# EAGLE design pinky 2.2 (v-usb) (EAGLE 6.4)
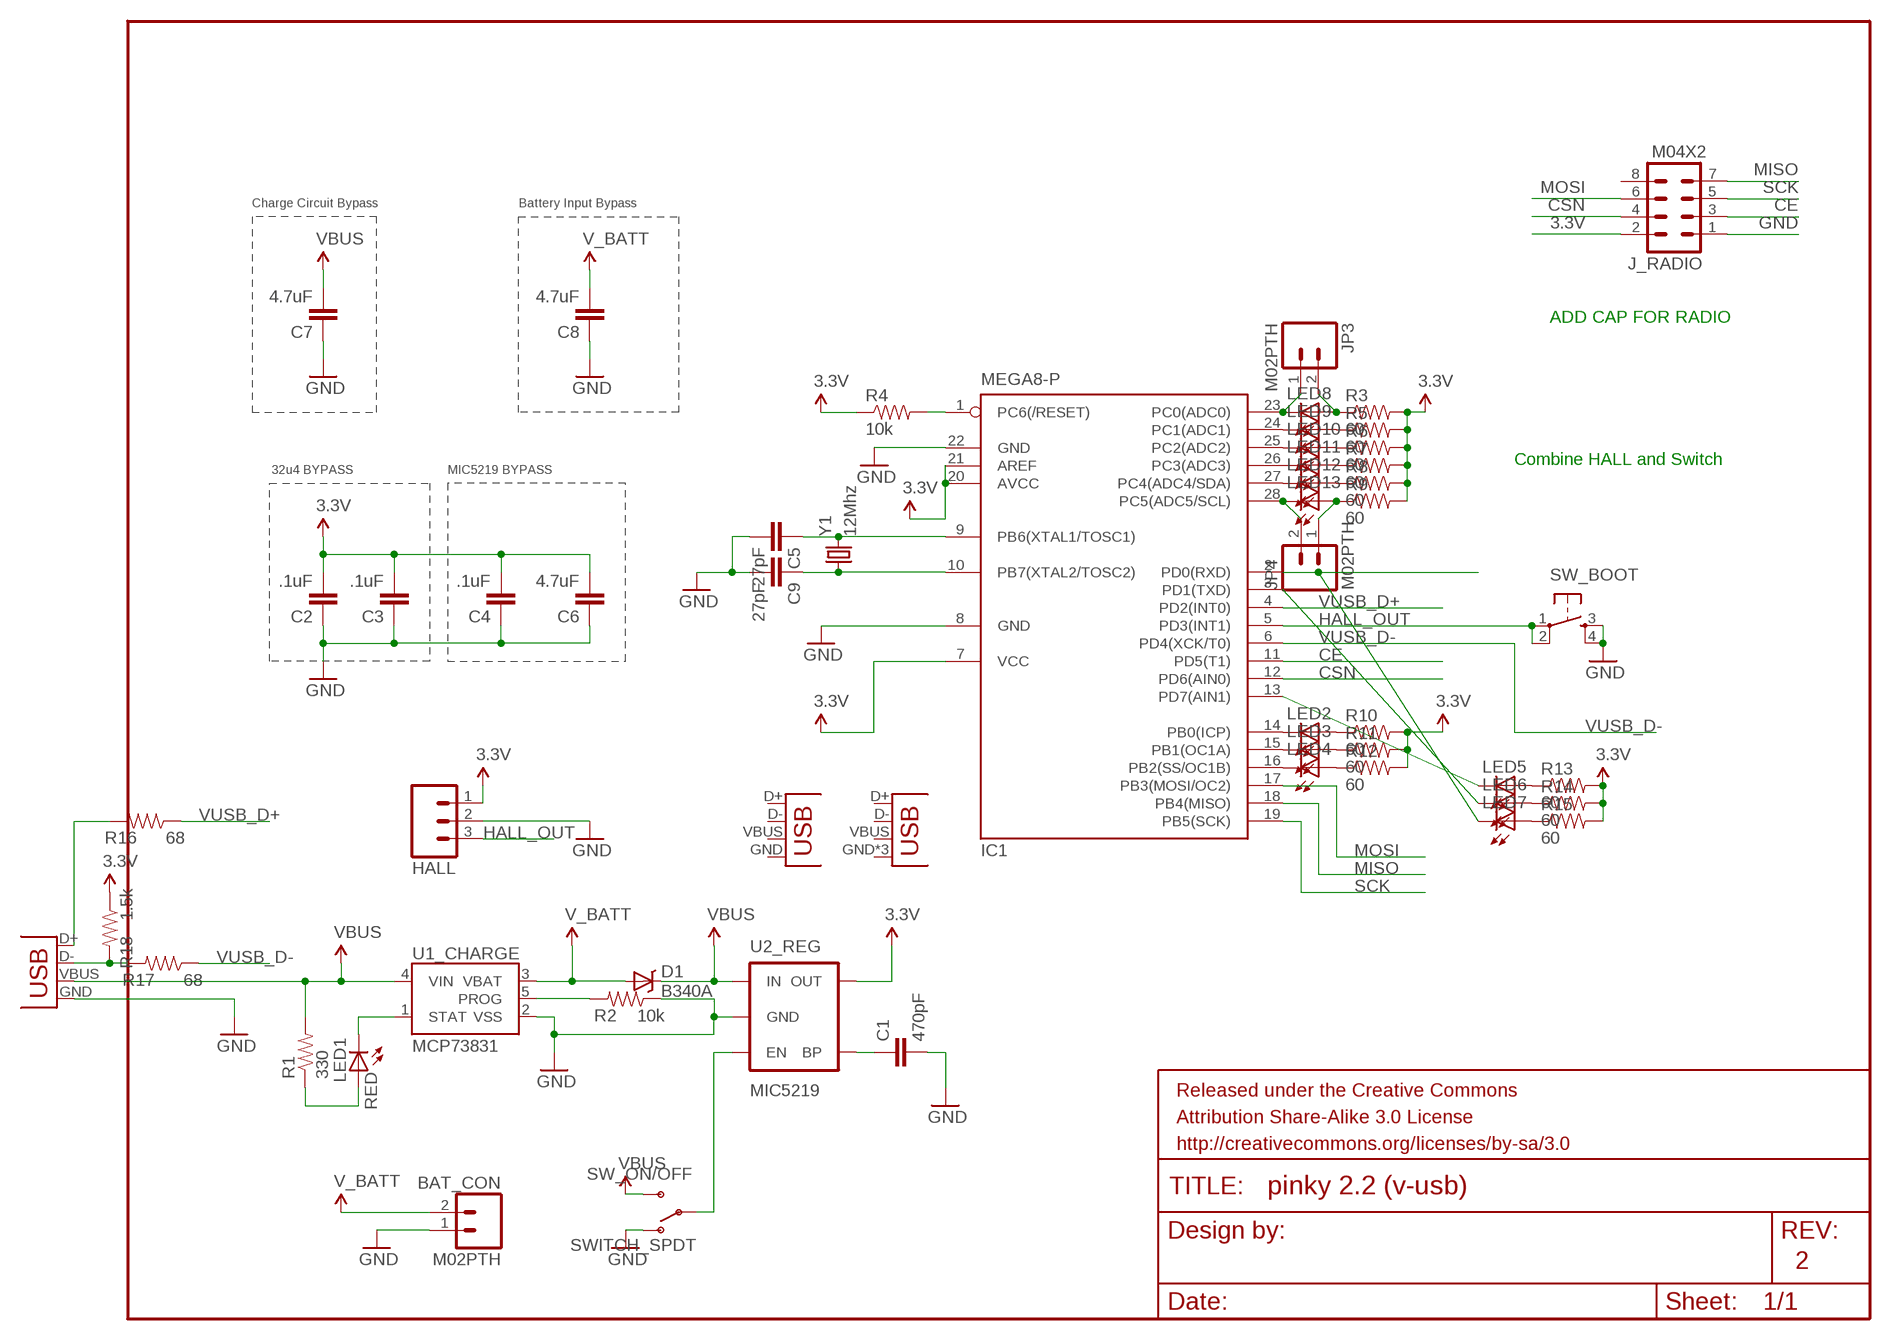
[diagram p0: schematic, sheet 1]

## Parts
BAT_CON  M02PTH  [1X02]
C1  470pF  CAP1206  [1206]
C2  .1uF  CAP1206  [1206]
C3  .1uF  CAP1206  [1206]
C4  .1uF  CAP1206  [1206]
C5  27pF  CAP1206  [1206]
C6  4.7uF  CAP1206  [1206]
C7  4.7uF  CAP1206  [1206]
C8  4.7uF  CAP1206  [1206]
C9  27pF  CAP1206  [1206]
D1  B340A  DIODE-SCHOTTKY_  [SMA-DIODE]
HALL  M03PTH  [1X03]
IC1  MEGA8-P  [DIL28-3]
J_RADIO  M04X2  [2X4]
JP1  USB-MB-H  [USB-MB-H]
JP2  USB-MICROB  [USB-MICROB]
JP3  M02PTH  [1X02]
JP4  M02PTH  [1X02]
LED1  RED  LED1206  [LED-1206]
LED2  LED1206  [LED-1206]
LED3  LED1206  [LED-1206]
LED4  LED1206  [LED-1206]
LED5  LED1206  [LED-1206]
LED6  LED1206  [LED-1206]
LED7  LED1206  [LED-1206]
LED8  LED1206  [LED-1206]
LED9  LED1206  [LED-1206]
LED10  LED1206  [LED-1206]
LED11  LED1206  [LED-1206]
LED12  LED1206  [LED-1206]
LED13  LED1206  [LED-1206]
R1  330  RESISTOR1206  [1206]
R2  10k  RESISTOR1206  [1206]
R3  60  RESISTOR1206  [1206]
R4  10k  RESISTOR1206  [1206]
R5  60  RESISTOR1206  [1206]
R6  60  RESISTOR1206  [1206]
R7  60  RESISTOR1206  [1206]
R8  60  RESISTOR1206  [1206]
R9  60  RESISTOR1206  [1206]
R10  60  RESISTOR1206  [1206]
R11  60  RESISTOR1206  [1206]
R12  60  RESISTOR1206  [1206]
R13  60  RESISTOR1206  [1206]
R14  60  RESISTOR1206  [1206]
R15  60  RESISTOR1206  [1206]
R16  68  RESISTOR1206  [1206]
R17  68  RESISTOR1206  [1206]
R18  1.5k  RESISTOR1206  [1206]
SW_BOOT  TAC_SWITCHPTH  [TACTILE-PTH]
SW_ON/OFF  SWITCH_SPDT  [KPS-1290]
U1_CHARGE  MCP73831  [SOT23-5]
U2_REG  MIC5219  V_REG_MIC5219SMD  [SOT23-5]
X1_USB_MICRO  USBSMD  [USB-MINIB]
Y1  12Mhz  CRYSTAL5X3  [CRYSTAL-SMD-5X3]

## Nets
3.3V: C2.2 C3.2 C4.2 C6.2 HALL.1 IC1.7(VCC) IC1.20(AVCC) IC1.21(AREF) J_RADIO.2 R3.2 R4.1 R5.2 R6.2 R7.2 R8.2 R9.2 R10.2 R11.2 R12.2 R13.2 R14.2 R15.2 R18.1 U2_REG.5(OUT)
5V: C7.2 D1.C R1.2 SW_ON/OFF.S U1_CHARGE.4(VIN) U2_REG.1(IN) X1_USB_MICRO.VBUS ; supply symbol labelled VBUS
CE: IC1.11(PD5(T1)) J_RADIO.3
CSN: IC1.12(PD6(AIN0)) J_RADIO.4
GND: BAT_CON.1 C1.2 C2.1 C3.1 C4.1 C5.2 C6.1 C7.1 C8.1 C9.2 HALL.2 IC1.8(GND) IC1.22(GND) J_RADIO.1 R2.1 SW_BOOT.3 SW_BOOT.4 SW_ON/OFF.O U1_CHARGE.2(VSS) U2_REG.2(GND) X1_USB_MICRO.GND
HALL_OUT: HALL.3 IC1.5(PD3(INT1)) SW_BOOT.1 SW_BOOT.2
MISO: IC1.18(PB4(MISO)) J_RADIO.7
MOSI: IC1.17(PB3(MOSI/OC2)) J_RADIO.6
N$1: IC1.1(PC6(/RESET)) R4.2
N$2: SW_ON/OFF.P U2_REG.3(EN)
N$3: LED1.A R1.1
N$4: LED1.C U1_CHARGE.1(STAT)
N$5: IC1.14(PB0(ICP)) LED2.C
N$6: R2.2 U1_CHARGE.5(PROG)
N$7: IC1.15(PB1(OC1A)) LED3.C
N$8: C1.1 U2_REG.4(BP)
N$9: IC1.16(PB2(SS/OC1B)) LED4.C
N$10: IC1.2(PD0(RXD)) LED7.C
N$11: IC1.13(PD7(AIN1)) LED5.C
N$12: IC1.3(PD1(TXD)) LED6.C
N$13: IC1.23(PC0(ADC0)) JP3.1 LED8.C
N$14: IC1.24(PC1(ADC1)) LED9.C
N$15: IC1.25(PC2(ADC2)) LED10.C
N$16: IC1.26(PC3(ADC3)) LED11.C
N$17: IC1.27(PC4(ADC4/SDA)) LED12.C
N$18: IC1.28(PC5(ADC5/SCL)) JP4.2 LED13.C
N$19: JP3.2 LED8.A R3.1
N$20: LED9.A R5.1
N$21: LED10.A R6.1
N$22: LED11.A R7.1
N$23: LED12.A R8.1
N$25: JP4.1 LED13.A R9.1
N$26: LED2.A R10.1
N$27: LED3.A R11.1
N$28: LED4.A R12.1
N$29: LED5.A R13.1
N$30: LED6.A R14.1
N$31: LED7.A R15.1
N$32: R16.2 X1_USB_MICRO.D+
N$33: R17.2 R18.2 X1_USB_MICRO.D-
N$34: C5.1 IC1.9(PB6(XTAL1/TOSC1)) Y1.3
N$35: C9.1 IC1.10(PB7(XTAL2/TOSC2)) Y1.1
SCK: IC1.19(PB5(SCK)) J_RADIO.5
V_BATT: BAT_CON.2 C8.2 D1.A U1_CHARGE.3(VBAT)
VUSB_D+: IC1.4(PD2(INT0)) R16.1
VUSB_D-: IC1.6(PD4(XCK/T0)) R17.1
Unconnected: J_RADIO.8 JP1.D+ JP1.D- JP1.GND JP1.VBUS JP2.D+ JP2.D- JP2.GND JP2.MT1(GND) JP2.MT2(GND) JP2.VBUS

## Notes on the sheet
- Charge Circuit Bypass | Battery Input Bypass
- ADD CAP FOR RADIO
- Combine HALL and Switch
- 32u4 BYPASS | MIC5219 BYPASS
- 2

## Library data of the parts
BAT_CON JP3 JP4 = SparkFun-Connectors:M02: Standard 2-pin 0.1" header. Use with - straight break away headers ( PRT-00116) - right angle break away headers (PRT-00553) - swiss pins (PRT-00743) - machine pins (PRT-00117) - female headers (PRT-00115) Molex polarized connector foot print use with: PRT-08233 with associated crimp pins and housings. 2.54_SCREWTERM for use with PRT-10571. 3.5mm Screw Terminal footprints for PRT-08084 5mm Screw Terminal footprints for use with PRT-08433
C1 = SparkFun-Passives:CAP: Capacitor Standard 0603 ceramic capacitor, and 0.1" leaded capacitor.; PROD_ID: CAP-07884
C2-C4 = SparkFun-Passives:CAP: Capacitor Standard 0603 ceramic capacitor, and 0.1" leaded capacitor.; PROD_ID: CAP-00810
C5 C7-C9 = SparkFun-Passives:CAP: Capacitor Standard 0603 ceramic capacitor, and 0.1" leaded capacitor.; PROD_ID: CAP-10300
C6 = SparkFun-Passives:CAP: Capacitor Standard 0603 ceramic capacitor, and 0.1" leaded capacitor.; PROD_ID: CAP-08280
D1 = SparkFun-DiscreteSemi:DIODE-SCHOTTKY: Commonly MBRA140.; PROD_ID: DIO-09886
HALL = SparkFun-Connectors:M03: Header 3 Standard 3-pin 0.1" header. Use with straight break away headers (SKU : PRT-00116), right angle break away headers (PRT-00553), swiss pins (PRT-00743), machine pins (PRT-00117), and female headers (PRT-00115). Molex polarized connector foot print use with SKU : PRT-08232 with associated crimp pins and housings.
IC1 = atmel:MEGA8-P: MICROCONTROLLER 8 Kbytes FLASH, 1 kbytes SRAM, 512 bytes EEPROM, USART, 4-channel 10 bit ADC, 2-channel 8 bit ADC Pin compatible with Atmega48, ATMega88, ATMega168 Source: avr.lbr; OC_FARNELL: unknown; OC_NEWARK: unknown
J_RADIO = SparkFun-Connectors:M04X2: .1" header, two rows of four.
JP1 X1_USB_MICRO = SparkFun-Connectors:USB: USB Connectors USB-B-PTH is fully proven SKU : PRT-00139/CONN-08278 USB-miniB is fully proven SKU : PRT-00587 USB-A-PCB is untested. USB-A-H is throughly reviewed, but untested. Spark Fun Electronics SKU : PRT-00437 USB-B-SMT is throughly reviewed, but untested. Needs silkscreen touching up. USB-A-S has not been used/tested USB-MB-H has not been used/tested USB-MICROB has been used. CONN-09505
JP2 = SparkFun-Connectors:USB: USB Connectors USB-B-PTH is fully proven SKU : PRT-00139/CONN-08278 USB-miniB is fully proven SKU : PRT-00587 USB-A-PCB is untested. USB-A-H is throughly reviewed, but untested. Spark Fun Electronics SKU : PRT-00437 USB-B-SMT is throughly reviewed, but untested. Needs silkscreen touching up. USB-A-S has not been used/tested USB-MB-H has not been used/tested USB-MICROB has been used. CONN-09505; PROD_ID: CONN-09505
LED1 = SparkFun-LED:LED: LEDs Standard schematic elements and footprints for 5mm, 3mm, 1206, and 0603 sized LEDs. 5mm - Spark Fun Electronics SKU : COM-00529 (and others); PROD_ID: DIO-00819
LED2-LED13 = SparkFun-LED:LED: LEDs Standard schematic elements and footprints for 5mm, 3mm, 1206, and 0603 sized LEDs. 5mm - Spark Fun Electronics SKU : COM-00529 (and others)
R1 = SparkFun-Passives:RESISTOR: Resistor Basic schematic elements and footprints for 0603, 1206, and PTH resistors.; PROD_ID: RES-00818
R2-R18 = SparkFun-Passives:RESISTOR: Resistor Basic schematic elements and footprints for 0603, 1206, and PTH resistors.; PROD_ID: RES-00824
SW_BOOT = SparkFun-Electromechanical:TAC_SWITCH: Momentary Switch Button commonly used for reset or general input. Spark Fun Electronics SKU : COM-00097 SMT- SWCH-08247
SW_ON/OFF = SparkFun-Electromechanical:SWITCH_SPDT: Side-actuated SPDT slide switch, as used on the Arduino Pro
U1_CHARGE = SparkFun-PowerIC:MCP73831: Miniature single cell, fully integrated Li-Ion, Li-polymer charge management controller http://ww1.microchip.com/downloads/en/DeviceDoc/21984a.pdf; PROD_ID: IC-09995
U2_REG = SparkFun-PowerIC:V_REG_MIC5219: V_REG MIC5219 Standard 500mA LDO voltage regulator in SOT-23 layout. Micrel part MIC5219. BP (by-pass) pin is used to lower output noise with 470pF cap, may be left open.; PROD_ID: VREG-09872
Y1 = SparkFun-FreqCtrl:CRYSTAL: Various standard crystals. Proven footprints. Spark Fun Electronics SKU : COM-00534

## Board
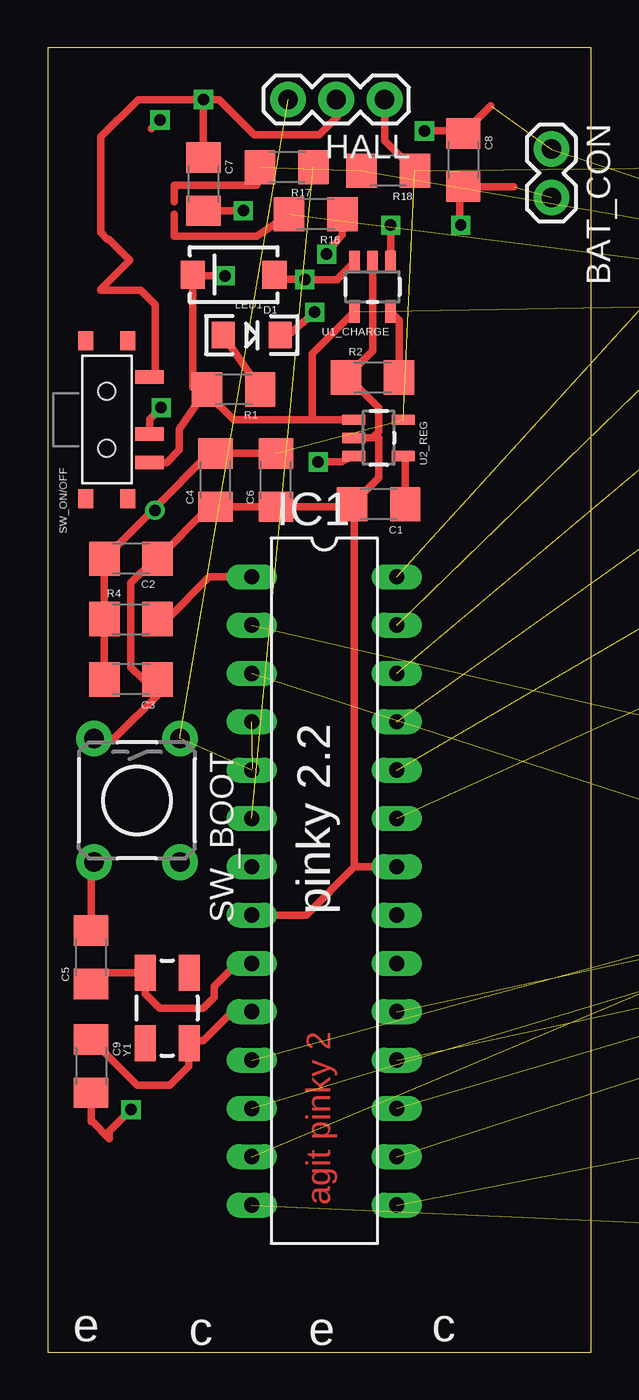
[diagram p1: board, top side]
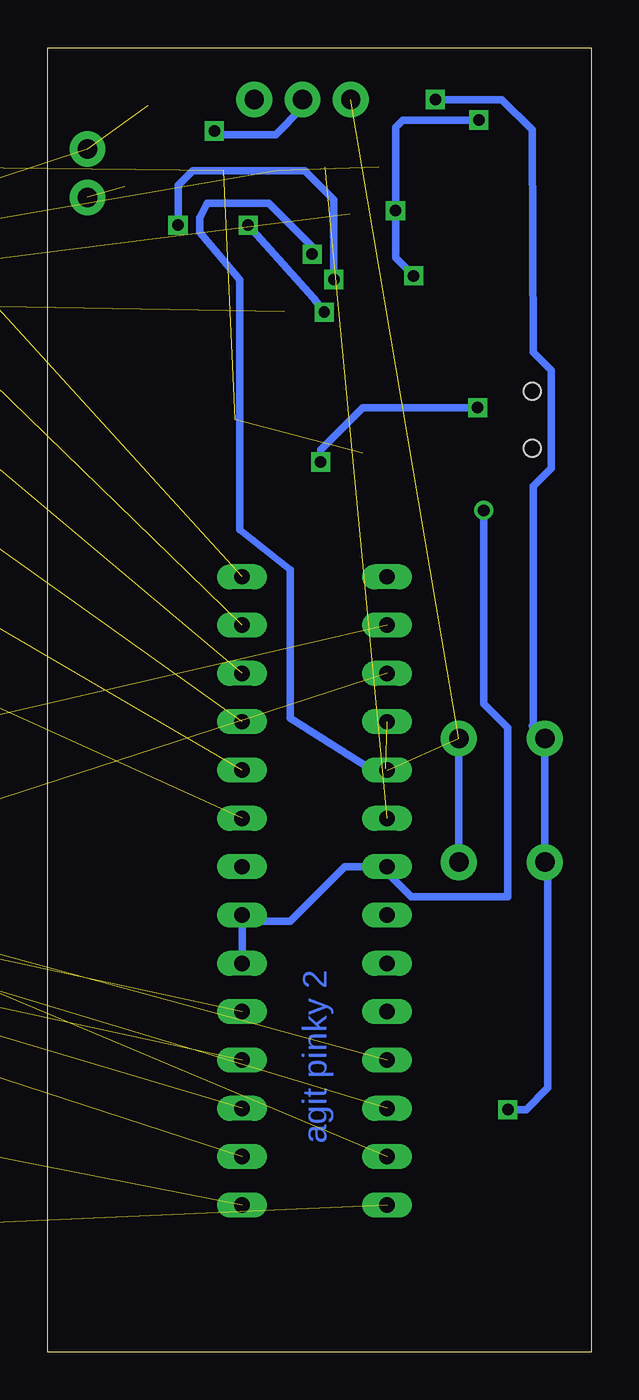
[diagram p2: board, bottom side, seen from below]

Size 28.57 x 68.58 mm. Coordinates in mm from the lower left corner, seen from the top.
Outline: 0,0 28.57,0 28.57,68.58 0,68.58 0,0
Copper layers (1*16): Top 0.035mm / dielectric 1.5mm / Bottom 0.035mm
Design rules "default *": minimum track width 16mil, minimum drill 24mil, track to track 8mil, track to pad 8mil, pad to pad 8mil, via to via 8mil, smd to smd 8mil, copper to edge 40mil, drill to drill 8mil, minimum pad ring 10mil, minimum via ring 8mil, stop-mask expansion 4mil, vias tented up to drill 0mil, thermal gap 10mil

### Footprints (pad centres in the part's own frame; a part is rotated, then mirrored left to right if it is on the bottom)
1X02 = drill 1.016 pad 1.88: 1 0,0; 2 2.54,0
1206 = smd 1.6 x 1.8: 1 -1.4,0; 2 1.4,0
SMA-DIODE = smd 1.27 x 1.47: A -2.15,0; C 2.15,0
1X03 = drill 1.016 pad 1.88: 1 0,0; 2 2.54,0; 3 5.08,0
DIL28-3 = drill 0.813 long: 1 -16.51,-3.81; 2 -13.97,-3.81; 3 -11.43,-3.81; 4 -8.89,-3.81; 5 -6.35,-3.81; 6 -3.81,-3.81; 7 -1.27,-3.81; 8 1.27,-3.81; 9 3.81,-3.81; 10 6.35,-3.81; 11 8.89,-3.81; 12 11.43,-3.81; 13 13.97,-3.81; 14 16.51,-3.81; 15 16.51,3.81; 16 13.97,3.81; 17 11.43,3.81; 18 8.89,3.81; 19 6.35,3.81; 20 3.81,3.81; 21 1.27,3.81; 22 -1.27,3.81; 23 -3.81,3.81; 24 -6.35,3.81; 25 -8.89,3.81; 26 -11.43,3.81; 27 -13.97,3.81; 28 -16.51,3.81
2X4 = drill 1.016 pad 1.88 octagon: 1 -3.81,-1.27; 2 -3.81,1.27; 3 -1.27,-1.27; 4 -1.27,1.27; 5 1.27,-1.27; 6 1.27,1.27; 7 3.81,-1.27; 8 3.81,1.27
USB-MB-H = drill 0.8: D+ 5.1,0; D- 3.9,0.8; GND 5.1,-1.6; ID 3.9,-0.8; VBUS 5.1,1.6 | drill 1.9: P$6 0,-3.65; P$7 0,3.65
USB-MICROB = smd 0.35 x 1.4: D+ 0,2.65; D- -0.65,2.65; GND 1.3,2.65; ID 0.65,2.65; VBUS -1.3,2.65 | smd 1.8 x 1.9: MT1 -4,0; MT2 4,0 | smd 1.9 x 1.9: P$1 -1.27,0; P$2 1.27,0
LED-1206 = smd 1.2 x 1.4: A -1.5,0; C 1.5,0
TACTILE-PTH = drill 1.016 pad 1.88: 1 -3.251,2.261; 2 3.251,2.261; 3 -3.251,-2.261; 4 3.251,-2.261
KPS-1290 = smd 0.7 x 1.5: O -2.25,2.25; P 0.75,2.25; S 2.25,2.25 | smd 1 x 0.8: P$1 -4.15,1.1; P$2 -4.15,-1.1; P$3 4.15,-1.1; P$4 4.15,1.1 | hole 0.9: -1.5,0; 1.5,0
SOT23-5 = smd 0.55 x 1.2: 1 -0.95,-1.3; 2 0,-1.3; 3 0.95,-1.3; 4 0.95,1.3; 5 -0.95,1.3
USB-MINIB = smd 2.5 x 0.5: D+ 2.5,0; D- 2.5,0.8; GND 2.5,-1.6; ID 2.5,-0.8; VBUS 2.5,1.6 | smd 2.5 x 2: MTN1 -3,4.5; MTN2 2.5,4.5; MTN3 -3,-4.5; MTN4 2.5,-4.5 | hole 0.9: 0,2.2; 0,-2.2
CRYSTAL-SMD-5X3 = smd 1.9 x 1.1: 1 -1.85,-1.15; 2 1.85,-1.15; 3 1.85,1.15; 4 -1.85,1.15

### Placement (x,y rotation side)
BAT_CON  26.48,63.25 270 top
C1  17.4,44.58 180 top
C2  4.38,41.72 180 top
C3  4.38,35.37 180 top
C4  8.83,45.85 90 top
C5  2.29,20.76 90 top
C6  12,45.85 90 top
C7  8.19,61.4 270 top
C8  21.84,62.67 270 top
C9  2.29,15.05 270 top
D1  9.78,56.64 180 top
HALL  17.72,65.85 180 top
IC1  14.54,24.26 270 top
J_RADIO  72.77,30.67 270 top  (outside the outline)
JP1  74.68,53.34 0 top  (outside the outline)
JP2  64.77,54.29 270 top  (outside the outline)
JP3  40.64,36.83 270 top  (outside the outline)
JP4  40.64,59.69 90 top  (outside the outline)
LED1  10.73,53.47 0 top
LED2  38.04,5.02 90 top  (outside the outline)
LED3  38.04,10.1 90 top  (outside the outline)
LED4  38.04,15.18 90 top  (outside the outline)
LED5  38.04,20.26 90 top  (outside the outline)
LED6  38.04,25.34 90 top  (outside the outline)
LED7  38.04,30.42 90 top  (outside the outline)
LED8  38.04,35.5 90 top  (outside the outline)
LED9  38.04,40.58 90 top  (outside the outline)
LED10  38.04,45.66 90 top  (outside the outline)
LED11  38.04,50.74 90 top  (outside the outline)
LED12  38.04,55.82 90 top  (outside the outline)
LED13  38.04,60.9 90 top  (outside the outline)
R1  9.78,50.61 180 top
R2  17.08,51.24 0 top
R3  35.5,35.5 90 top  (outside the outline)
R4  4.38,38.54 0 top
R5  35.56,40.58 90 top  (outside the outline)
R6  35.56,45.66 90 top  (outside the outline)
R7  35.56,50.74 90 top  (outside the outline)
R8  35.56,55.82 90 top  (outside the outline)
R9  35.56,60.9 90 top  (outside the outline)
R10  35.62,5.02 90 top  (outside the outline)
R11  35.62,10.1 90 top  (outside the outline)
R12  35.56,15.18 90 top  (outside the outline)
R13  35.56,20.26 90 top  (outside the outline)
R14  35.56,25.34 90 top  (outside the outline)
R15  35.56,30.42 90 top  (outside the outline)
R16  14.1,59.82 180 top
R17  12.57,62.29 180 top
R18  17.91,62.1 180 top
SW_BOOT  4.7,29.02 270 top
SW_ON/OFF  3.11,49.02 270 top
U1_CHARGE  17.08,56.01 180 top
U2_REG  17.4,48.07 270 top
X1_USB_MICRO  57.34,53.85 0 top  (outside the outline)
Y1  6.29,18.1 90 top

### Tracks (layer width: path | path; a pad name or v marks a point on that pad's centre or on a via)
3.3V  (via drill 0.61)  (15 unrouted)
  Top 0.406: C6.2 C4.2 8.51,47.25 5.59,44.33 | 5.59,44.33 C2.2 R4.1 C3.2 | v5.65,44.26 5.59,44.33 | HALL.1 17.72,63.69 R18.1
  Bottom 0.406: IC1.20 IC1.21 18.03,22.67 15.81,22.67 12.95,25.53 IC1.7 10.73,25.21 9.46,23.94 4.38,23.94 4.38,32.83 5.65,34.1 v5.65,44.26
5V  (via drill 0.6)  (1 unrouted)
  Top 0.406: R1.2 7.63,50.72 D1.C 7.69,56.58 v9.34,56.58 | SW_ON/OFF.S 6.26,46.77 6.92,47.43 6.92,48.52 R1.2 | R1.2 8.38,50.42 9.78,49.02 13.91,49.02 | 13.91,49.02 U2_REG.1 13.91,49.02 | 13.91,49.02 13.91,52.48 U1_CHARGE.4 | C7.2 v10.29,60.01 | 5.44,64.31 v5.91,64.77
  Bottom 0.406: v9.34,56.58 10.29,57.53 v10.29,60.01 10.29,64.39 9.91,64.77 v5.91,64.77
CE  (1 unrouted)
CSN  (1 unrouted)
GND  (via drill 0.6)  (3 unrouted)
  Top 0.406: SW_BOOT.3 3.5,32.27 5.97,34.73 5.97,35.18 C3.1 5.02,35.37 4.38,36.01 4.38,40.45 5.65,41.72 C2.1 8.51,44.45 C4.1 C6.1 | SW_ON/OFF.O 5.65,51.56 5.65,55.05 4.89,55.82 2.79,55.82 2.79,55.87 4.32,57.4 3.21,58.52 3.14,58.52 2.79,58.86 2.79,63.88 4.76,65.85 v8.19,65.85 | C1.2 17.4,45.98 17.4,48.07 U2_REG.2 17.08,48.07 17.4,48.39 17.4,49.66 15.81,51.24 R2.1 17.08,52.65 U1_CHARGE.2 | 16.13,25.53 IC1.22 | C6.1 12.45,44.45 12.64,44.26 12.19,44.26 C6.1 | C6.1 15.87,44.45 C1.2 | C7.1 8.38,62.8 8.19,62.99 v8.19,65.85 | 23.3,65.53 C8.1 | IC1.8 13.59,22.99 16.13,25.53 | 16.13,25.53 16.13,44.45 C1.2 | 21.78,64.01 C8.1 | 2.29,12.13 C9.2 2.29,12.19 3.24,11.24 3.24,11.62 v4.38,12.76 | C5.2 2.29,25.62 SW_BOOT.4 | v8.19,65.85 9.02,65.85 10.86,64.01 14.29,64.01 15.24,64.96 15.24,65.79 HALL.2 | v19.81,64.2 21.72,64.2 C8.1
  Bottom 0.406: v8.19,65.85 4.7,65.85 3.11,64.26 3.05,52.58 2.1,51.63 2.1,46.48 3.05,45.53 3.05,32.94 3.11,32.94 SW_BOOT.3 SW_BOOT.4 2.29,25.62 2.29,13.91 3.43,12.76 v4.38,12.76 | HALL.2 15.18,65.41 16.57,64.01 19.62,64.01 v19.81,64.2
HALL_OUT  (2 unrouted)
  Bottom 0.406: SW_BOOT.1 SW_BOOT.2
MISO  (1 unrouted)
MOSI  (1 unrouted)
N$1
  Top 0.406: R4.2 6.29,38.54 8.51,40.77 IC1.1
N$2  (via drill 0.6)
  Top 0.406: SW_ON/OFF.P 5.36,49.05 v5.97,49.66 | v14.22,46.8 15.46,46.8 U2_REG.3
  Bottom 0.406: v5.97,49.66 12,49.66 14.22,47.43 v14.22,46.8
N$3
  Top 0.406: R1.1 9.91,52.47 LED1.A
N$4  (via drill 0.6)
  Top 0.406: LED1.C 12.64,53.47 v14.03,54.67 | v18.03,59.24 U1_CHARGE.1
  Bottom 0.406: v14.03,54.67 14.61,55.44 v18.03,59.24
N$5  (1 unrouted)
N$6
  Top 0.406: R2.2 18.48,54.26 U1_CHARGE.5
N$7  (1 unrouted)
N$8
  Top 0.406: C1.1 18.8,47.02 U2_REG.4
N$9  (1 unrouted)
N$10  (1 unrouted)
N$11  (1 unrouted)
N$12  (1 unrouted)
N$13  (2 unrouted)
N$14  (1 unrouted)
N$15  (1 unrouted)
N$16  (1 unrouted)
N$17  (1 unrouted)
N$18  (2 unrouted)
N$19  (2 unrouted)
N$20  (1 unrouted)
N$21  (1 unrouted)
N$22  (1 unrouted)
N$23  (1 unrouted)
N$25  (2 unrouted)
N$26  (1 unrouted)
N$27  (1 unrouted)
N$28  (1 unrouted)
N$29  (1 unrouted)
N$30  (1 unrouted)
N$31  (1 unrouted)
N$32  (1 unrouted)
  Top 0.406: 6.67,59.82 6.67,58.67 10.98,58.67 R16.2
N$33  (2 unrouted)
  Top 0.406: 6.67,60.47 6.67,61.34 10.98,61.34 R17.2
N$34
  Top 0.406: C5.1 2.68,19.95 Y1.3 5.14,18.86 5.91,18.1 8.19,18.1 8.76,18.67 8.76,19.24 9.97,20.45 IC1.9
N$35
  Top 0.406: IC1.10 9.72,17.91 8.19,16.38 7.57,16.38 Y1.1 7.43,15.05 6.41,14.03 4.71,14.03 C9.1
SCK  (1 unrouted)
V_BATT  (via drill 0.6)  (1 unrouted)
  Top 0.406: D1.A 12,56.4 13.15,56.4 v13.53,56.39 15.23,56.39 15.22,56.4 U1_CHARGE.3 | 24.51,61.27 C8.2 21.66,61.09 21.66,59.31 v21.72,59.24
  Bottom 0.406: v21.72,59.24 21.72,61.34 20.95,62.1 15.05,62.1 13.53,60.58 v13.53,56.39
VUSB_D+  (via drill 0.6)  (1 unrouted)
  Top 0.406: R16.1 15.5,58.74 v14.67,57.72
  Bottom 0.406: v14.67,57.72 14.67,58.1 16.95,60.39 20.19,60.39 20.57,59.63 20.57,58.86 18.48,56.39 18.48,43.24 15.81,41.15 15.81,33.34 11.62,30.67 10.79,30.67
VUSB_D-  (1 unrouted)
(copper drawn outside any net)
  shapes: Bottom area x1

### Text on the board
Top: agit pinky 2
Bottom: agit pinky 2
tPlace: pinky 2.2 | e | c | c | e
tOrigins: - | +